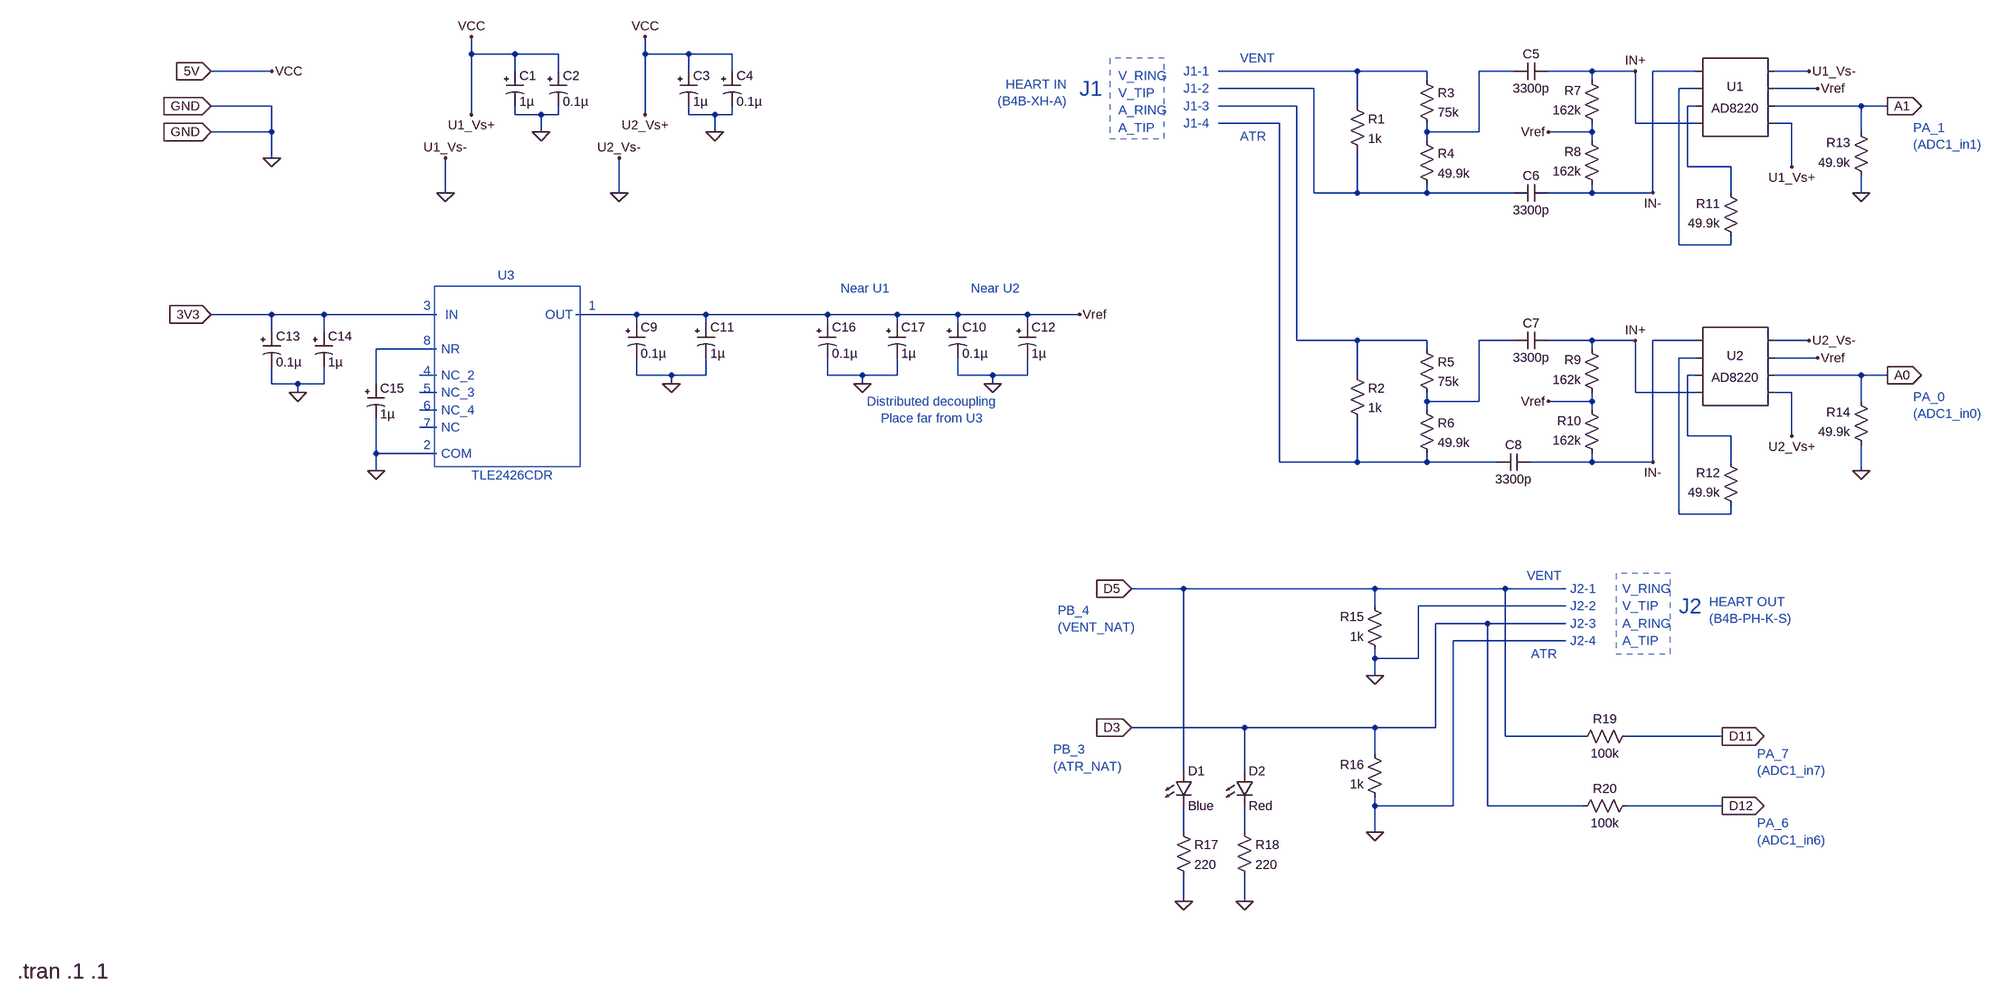
[diagram p0: schematic nucleo_shield_heart_interface_rev2.asc]
nucleo_shield_heart_interface_rev2.asc, the LTspice schematic file:
Version 4
SHEET 1 3972 3216
WIRE -1184 480 -1184 448
WIRE -1104 480 -1184 480
WIRE -1024 480 -1104 480
WIRE -864 480 -864 448
WIRE -784 480 -864 480
WIRE -704 480 -784 480
WIRE -1552 512 -1664 512
WIRE -1104 512 -1104 480
WIRE -1024 512 -1024 480
WIRE -784 512 -784 480
WIRE -704 512 -704 480
WIRE 448 512 192 512
WIRE 576 512 448 512
WIRE 736 512 672 512
WIRE 880 512 800 512
WIRE 960 512 880 512
WIRE 1072 512 992 512
WIRE 1280 512 1216 512
WIRE 576 528 576 512
WIRE 880 528 880 512
WIRE 368 544 192 544
WIRE 1072 544 1040 544
WIRE 1296 544 1216 544
WIRE -1552 576 -1664 576
WIRE 336 576 192 576
WIRE 448 576 448 512
WIRE 1072 576 1056 576
WIRE 1376 576 1216 576
WIRE 1424 576 1376 576
WIRE -1184 592 -1184 480
WIRE -1104 592 -1104 576
WIRE -1056 592 -1104 592
WIRE -1024 592 -1024 576
WIRE -1024 592 -1056 592
WIRE -864 592 -864 480
WIRE -784 592 -784 576
WIRE -736 592 -784 592
WIRE -704 592 -704 576
WIRE -704 592 -736 592
WIRE 304 608 192 608
WIRE 960 608 960 512
WIRE 1072 608 960 608
WIRE 1248 608 1216 608
WIRE -1552 624 -1552 576
WIRE -1552 624 -1664 624
WIRE -1056 624 -1056 592
WIRE -736 624 -736 592
WIRE 576 624 576 608
WIRE 672 624 672 512
WIRE 672 624 576 624
WIRE 880 624 880 608
WIRE 880 624 800 624
WIRE 1376 624 1376 576
WIRE 576 640 576 624
WIRE 880 640 880 624
WIRE -1552 672 -1552 624
WIRE 1056 688 1056 576
WIRE 1136 688 1056 688
WIRE 1248 688 1248 608
WIRE -1232 736 -1232 672
WIRE -912 736 -912 672
WIRE 368 736 368 544
WIRE 448 736 448 656
WIRE 448 736 368 736
WIRE 576 736 576 720
WIRE 576 736 448 736
WIRE 736 736 576 736
WIRE 880 736 880 720
WIRE 880 736 800 736
WIRE 992 736 992 512
WIRE 992 736 880 736
WIRE 1136 736 1136 688
WIRE 1376 736 1376 704
WIRE 1040 832 1040 544
WIRE 1136 832 1136 816
WIRE 1136 832 1040 832
WIRE -1552 960 -1664 960
WIRE -1456 960 -1552 960
WIRE -1248 960 -1456 960
WIRE -880 960 -992 960
WIRE -752 960 -880 960
WIRE -528 960 -752 960
WIRE -400 960 -528 960
WIRE -288 960 -400 960
WIRE -160 960 -288 960
WIRE -64 960 -160 960
WIRE -880 976 -880 960
WIRE -752 976 -752 960
WIRE -528 976 -528 960
WIRE -400 976 -400 960
WIRE -288 976 -288 960
WIRE -160 976 -160 960
WIRE -1552 992 -1552 960
WIRE -1456 992 -1456 960
WIRE 336 1008 336 576
WIRE 448 1008 336 1008
WIRE 576 1008 448 1008
WIRE 736 1008 672 1008
WIRE 880 1008 800 1008
WIRE 960 1008 880 1008
WIRE 1072 1008 992 1008
WIRE 1280 1008 1216 1008
WIRE -1248 1024 -1360 1024
WIRE 576 1024 576 1008
WIRE 880 1024 880 1008
WIRE 1072 1040 1040 1040
WIRE 1296 1040 1216 1040
WIRE -1248 1072 -1280 1072
WIRE -880 1072 -880 1040
WIRE -816 1072 -880 1072
WIRE -752 1072 -752 1040
WIRE -752 1072 -816 1072
WIRE -528 1072 -528 1040
WIRE -464 1072 -528 1072
WIRE -400 1072 -400 1040
WIRE -400 1072 -464 1072
WIRE -288 1072 -288 1040
WIRE -224 1072 -288 1072
WIRE -160 1072 -160 1040
WIRE -160 1072 -224 1072
WIRE 448 1072 448 1008
WIRE 1072 1072 1056 1072
WIRE 1376 1072 1216 1072
WIRE 1424 1072 1376 1072
WIRE -1552 1088 -1552 1056
WIRE -1504 1088 -1552 1088
WIRE -1456 1088 -1456 1056
WIRE -1456 1088 -1504 1088
WIRE -1360 1088 -1360 1024
WIRE -816 1088 -816 1072
WIRE -464 1088 -464 1072
WIRE -224 1088 -224 1072
WIRE -1504 1104 -1504 1088
WIRE -1248 1104 -1280 1104
WIRE 960 1104 960 1008
WIRE 1072 1104 960 1104
WIRE 1248 1104 1216 1104
WIRE 576 1120 576 1104
WIRE 672 1120 672 1008
WIRE 672 1120 576 1120
WIRE 880 1120 880 1104
WIRE 880 1120 800 1120
WIRE 1376 1120 1376 1072
WIRE -1248 1136 -1280 1136
WIRE 576 1136 576 1120
WIRE 880 1136 880 1120
WIRE -1248 1168 -1280 1168
WIRE 1056 1184 1056 1072
WIRE 1136 1184 1056 1184
WIRE 1248 1184 1248 1104
WIRE -1360 1216 -1360 1152
WIRE -1248 1216 -1360 1216
WIRE 304 1232 304 608
WIRE 448 1232 448 1152
WIRE 448 1232 304 1232
WIRE 576 1232 576 1216
WIRE 576 1232 448 1232
WIRE 704 1232 576 1232
WIRE 880 1232 880 1216
WIRE 880 1232 768 1232
WIRE 992 1232 992 1008
WIRE 992 1232 880 1232
WIRE 1136 1232 1136 1184
WIRE -1360 1248 -1360 1216
WIRE 1376 1248 1376 1200
WIRE 1040 1328 1040 1040
WIRE 1136 1328 1136 1312
WIRE 1136 1328 1040 1328
WIRE 128 1552 32 1552
WIRE 480 1552 128 1552
WIRE 720 1552 480 1552
WIRE 832 1552 720 1552
WIRE 480 1584 480 1552
WIRE 832 1584 560 1584
WIRE 688 1616 592 1616
WIRE 832 1616 688 1616
WIRE 832 1648 624 1648
WIRE 480 1680 480 1664
WIRE 560 1680 560 1584
WIRE 560 1680 480 1680
WIRE 480 1712 480 1680
WIRE 240 1808 32 1808
WIRE 480 1808 240 1808
WIRE 592 1808 592 1616
WIRE 592 1808 480 1808
WIRE 720 1824 720 1552
WIRE 864 1824 720 1824
WIRE 1120 1824 944 1824
WIRE 480 1856 480 1808
WIRE 128 1888 128 1552
WIRE 240 1888 240 1808
WIRE 480 1952 480 1936
WIRE 624 1952 624 1648
WIRE 624 1952 480 1952
WIRE 688 1952 688 1616
WIRE 864 1952 688 1952
WIRE 1120 1952 944 1952
WIRE 128 2000 128 1952
WIRE 240 2000 240 1952
WIRE 480 2000 480 1952
WIRE 128 2128 128 2080
WIRE 240 2128 240 2080
FLAG 960 512 IN+
FLAG 992 736 IN-
FLAG 1424 576 A1
IOPIN 1424 576 Out
FLAG 1296 544 Vref
FLAG 800 624 Vref
FLAG 960 1008 IN+
FLAG 992 1232 IN-
FLAG 1424 1072 A0
IOPIN 1424 1072 Out
FLAG 1296 1040 Vref
FLAG 800 1120 Vref
FLAG 1376 736 0
FLAG 1376 1248 0
FLAG 32 1552 D5
IOPIN 32 1552 In
FLAG 32 1808 D3
IOPIN 32 1808 In
FLAG 128 2128 0
FLAG 240 2128 0
FLAG 480 1712 0
FLAG 480 2000 0
FLAG -1184 592 U1_Vs+
FLAG 1248 688 U1_Vs+
FLAG -1184 448 VCC
FLAG -1232 736 0
FLAG -1232 672 U1_Vs-
FLAG -1056 624 0
FLAG 1280 512 U1_Vs-
FLAG -864 592 U2_Vs+
FLAG -864 448 VCC
FLAG -912 736 0
FLAG -912 672 U2_Vs-
FLAG -736 624 0
FLAG 1280 1008 U2_Vs-
FLAG 1248 1184 U2_Vs+
FLAG -64 960 Vref
FLAG -816 1088 0
FLAG -464 1088 0
FLAG -1360 1248 0
FLAG -1504 1104 0
FLAG -1664 512 5V
IOPIN -1664 512 In
FLAG -1664 576 GND
IOPIN -1664 576 In
FLAG -1664 624 GND
IOPIN -1664 624 In
FLAG -1552 512 VCC
FLAG -1552 672 0
FLAG -1664 960 3V3
IOPIN -1664 960 In
FLAG 1120 1952 D12
IOPIN 1120 1952 Out
FLAG 1120 1824 D11
IOPIN 1120 1824 Out
FLAG -224 1088 0
SYMBOL res 432 560 R0
SYMATTR InstName R1
SYMATTR Value 1k
SYMBOL res 896 736 R180
WINDOW 0 36 76 Left 2
WINDOW 3 36 40 Left 2
SYMATTR InstName R8
SYMATTR Value 162k
SYMBOL res 896 624 R180
WINDOW 0 36 76 Left 2
WINDOW 3 36 40 Left 2
SYMATTR InstName R7
SYMATTR Value 162k
SYMBOL cap 800 496 R90
WINDOW 0 0 32 VBottom 2
WINDOW 3 32 32 VTop 2
SYMATTR InstName C5
SYMATTR Value 3300p
SYMBOL cap 800 720 R90
WINDOW 0 0 32 VBottom 2
WINDOW 3 32 32 VTop 2
SYMATTR InstName C6
SYMATTR Value 3300p
SYMBOL res 1152 832 R180
WINDOW 0 36 76 Left 2
WINDOW 3 36 40 Left 2
SYMATTR InstName R11
SYMATTR Value 49.9k
SYMBOL res 560 512 R0
SYMATTR InstName R3
SYMATTR Value 75k
SYMBOL res 560 624 R0
SYMATTR InstName R4
SYMATTR Value 49.9k
SYMBOL AutoGenerated/AD8220 1136 560 R0
SYMATTR InstName U1
SYMBOL res 432 1056 R0
SYMATTR InstName R2
SYMATTR Value 1k
SYMBOL res 896 1232 R180
WINDOW 0 36 76 Left 2
WINDOW 3 36 40 Left 2
SYMATTR InstName R10
SYMATTR Value 162k
SYMBOL res 896 1120 R180
WINDOW 0 36 76 Left 2
WINDOW 3 36 40 Left 2
SYMATTR InstName R9
SYMATTR Value 162k
SYMBOL cap 800 992 R90
WINDOW 0 0 32 VBottom 2
WINDOW 3 32 32 VTop 2
SYMATTR InstName C7
SYMATTR Value 3300p
SYMBOL cap 768 1216 R90
WINDOW 0 0 32 VBottom 2
WINDOW 3 32 32 VTop 2
SYMATTR InstName C8
SYMATTR Value 3300p
SYMBOL res 1152 1328 R180
WINDOW 0 36 76 Left 2
WINDOW 3 36 40 Left 2
SYMATTR InstName R12
SYMATTR Value 49.9k
SYMBOL res 560 1008 R0
SYMATTR InstName R5
SYMATTR Value 75k
SYMBOL res 560 1120 R0
SYMATTR InstName R6
SYMATTR Value 49.9k
SYMBOL AutoGenerated/AD8220 1136 1056 R0
SYMATTR InstName U2
SYMBOL res 1392 720 R180
WINDOW 0 36 76 Left 2
WINDOW 3 36 40 Left 2
SYMATTR InstName R13
SYMATTR Value 49.9k
SYMBOL res 1392 1216 R180
WINDOW 0 36 76 Left 2
WINDOW 3 36 40 Left 2
SYMATTR InstName R14
SYMATTR Value 49.9k
SYMBOL LED 112 1888 R0
SYMATTR InstName D1
SYMATTR Value Blue
SYMBOL LED 224 1888 R0
SYMATTR InstName D2
SYMATTR Value Red
SYMBOL res 112 1984 R0
SYMATTR InstName R17
SYMATTR Value 220
SYMBOL res 224 1984 R0
SYMATTR InstName R18
SYMATTR Value 220
SYMBOL res 496 1680 R180
WINDOW 0 36 76 Left 2
WINDOW 3 36 40 Left 2
SYMATTR InstName R15
SYMATTR Value 1k
SYMBOL res 496 1952 R180
WINDOW 0 36 76 Left 2
WINDOW 3 36 40 Left 2
SYMATTR InstName R16
SYMATTR Value 1k
SYMBOL polcap -1120 512 R0
SYMATTR InstName C1
SYMATTR Value 1µ
SYMBOL polcap -1040 512 R0
SYMATTR InstName C2
SYMATTR Value 0.1µ
SYMBOL polcap -800 512 R0
SYMATTR InstName C3
SYMATTR Value 1µ
SYMBOL polcap -720 512 R0
SYMATTR InstName C4
SYMATTR Value 0.1µ
SYMBOL polcap -896 976 R0
SYMATTR InstName C9
SYMATTR Value 0.1µ
SYMBOL polcap -304 976 R0
SYMATTR InstName C10
SYMATTR Value 0.1µ
SYMBOL polcap -176 976 R0
SYMATTR InstName C12
SYMATTR Value 1µ
SYMBOL polcap -768 976 R0
SYMATTR InstName C11
SYMATTR Value 1µ
SYMBOL polcap -544 976 R0
SYMATTR InstName C16
SYMATTR Value 0.1µ
SYMBOL polcap -416 976 R0
SYMATTR InstName C17
SYMATTR Value 1µ
SYMBOL polcap -1568 992 R0
SYMATTR InstName C13
SYMATTR Value 0.1µ
SYMBOL polcap -1472 992 R0
SYMATTR InstName C14
SYMATTR Value 1µ
SYMBOL polcap -1376 1088 R0
SYMATTR InstName C15
SYMATTR Value 1µ
SYMBOL res 848 1840 R270
WINDOW 0 32 56 VTop 2
WINDOW 3 0 56 VBottom 2
SYMATTR InstName R19
SYMATTR Value 100k
SYMBOL res 848 1968 R270
WINDOW 0 32 56 VTop 2
WINDOW 3 0 56 VBottom 2
SYMATTR InstName R20
SYMATTR Value 100k
TEXT -2064 2256 Left 4 !.tran .1 .1
TEXT -88 536 Right 2 ;HEART IN\n(B4B-XH-A)
TEXT 232 488 Left 2 ;VENT
TEXT 232 632 Left 2 ;ATR
TEXT 1096 1576 Left 2 ;HEART OUT\n(B4B-PH-K-S)
TEXT -1184 1256 Left 2 ;TLE2426CDR
TEXT -1136 888 Left 2 ;U3
TEXT -1048 960 Left 2 ;OUT
TEXT -1240 1072 Left 2 ;NC_2
TEXT -1240 1104 Left 2 ;NC_3
TEXT -1240 1136 Left 2 ;NC_4
TEXT -1240 1168 Left 2 ;NC
TEXT -1272 1064 Left 2 ;4
TEXT -1272 1096 Left 2 ;5
TEXT -1272 1128 Left 2 ;6
TEXT -1272 1160 Left 2 ;7
TEXT -1272 1200 Left 2 ;2
TEXT -1240 1216 Left 2 ;COM
TEXT -1240 1024 Left 2 ;NR
TEXT -1272 1008 Left 2 ;8
TEXT -1232 960 Left 2 ;IN
TEXT -1272 944 Left 2 ;3
TEXT -336 1136 Center 2 ;Distributed decoupling\nPlace far from U3
TEXT -968 944 Left 2 ;1
TEXT -64 544 Left 4 ;J1
TEXT 1040 1584 Left 4 ;J2
TEXT 128 512 Left 2 ;J1-1
TEXT 128 544 Left 2 ;J1-2
TEXT 128 576 Left 2 ;J1-3
TEXT 128 608 Left 2 ;J1-4
TEXT 840 1552 Left 2 ;J2-1
TEXT 840 1584 Left 2 ;J2-2
TEXT 840 1616 Left 2 ;J2-3
TEXT 840 1648 Left 2 ;J2-4
TEXT -104 1592 Left 2 ;PB_4\n(VENT_NAT)
TEXT -112 1848 Left 2 ;PB_3\n(ATR_NAT)
TEXT 1472 616 Left 2 ;PA_1\n(ADC1_in1)
TEXT 1472 1112 Left 2 ;PA_0\n(ADC1_in0)
TEXT 760 1528 Left 2 ;VENT
TEXT 768 1672 Left 2 ;ATR
TEXT 936 1552 Left 2 ;V_RING
TEXT 936 1584 Left 2 ;V_TIP
TEXT 936 1616 Left 2 ;A_RING
TEXT 936 1648 Left 2 ;A_TIP
TEXT 1184 1856 Left 2 ;PA_7\n(ADC1_in7)
TEXT 1184 1984 Left 2 ;PA_6\n(ADC1_in6)
TEXT 8 520 Left 2 ;V_RING
TEXT 8 552 Left 2 ;V_TIP
TEXT 8 584 Left 2 ;A_RING
TEXT 8 616 Left 2 ;A_TIP
TEXT -504 912 Left 2 ;Near U1
TEXT -264 912 Left 2 ;Near U2
RECTANGLE Normal -1252 908 -984 1240
RECTANGLE Normal 1024 1524 924 1672 2
RECTANGLE Normal 92 488 -8 636 2

The netlist it stands for:
* nucleo_shield_heart_interface_rev2.asc
R1 N001 N003 1k
R8 IN- Vref 162k
R7 Vref IN+ 162k
C5 IN+ N002 3300p
C6 IN- N003 3300p
R11 N004 N006 49.9k
R3 N001 N002 75k
R4 N002 N003 49.9k
* U1: AD8220 (symbol AutoGenerated/AD8220 not available, pins judged from their places): pin1=IN- pin2=N004 pin3=N006 pin4=IN+ pin5=0 pin6=Vref pin7=A1 pin8=5V
R2 N005 N007 1k
R10 IN- Vref 162k
R9 Vref IN+ 162k
C7 IN+ N008 3300p
C8 IN- N007 3300p
R12 N010 N012 49.9k
R5 N005 N008 75k
R6 N008 N007 49.9k
* U2: AD8220 (symbol AutoGenerated/AD8220 not available, pins judged from their places): pin1=IN- pin2=N010 pin3=N012 pin4=IN+ pin5=0 pin6=Vref pin7=A0 pin8=5V
R13 0 A1 49.9k
R14 0 A0 49.9k
D1 D5 N016 Blue
D2 D3 N017 Red
R17 N016 0 220
R18 N017 0 220
R15 0 D5 1k
R16 0 D3 1k
C1 5V 0 1µ
C2 5V 0 0.1µ
C3 5V 0 1µ
C4 5V 0 0.1µ
C9 Vref 0 0.1µ
C10 Vref 0 0.1µ
C12 Vref 0 1µ
C11 Vref 0 1µ
C16 Vref 0 0.1µ
C17 Vref 0 1µ
C13 3V3 0 0.1µ
C14 3V3 0 1µ
C15 N009 0 1µ
R19 D5 D11 100k
R20 D3 D12 100k
.model D D
.lib standard.dio
.tran .1 .1
* HEART IN
* (B4B-XH-A)
* VENT
* ATR
* HEART OUT
* (B4B-PH-K-S)
* TLE2426CDR
* U3
* OUT
* NC_2
* NC_3
* NC_4
* NC
* 4
* 5
* 6
* 7
* 2
* COM
* NR
* 8
* IN
* 3
* Distributed decoupling
* Place far from U3
* 1
* J1
* J2
* J1-1
* J1-2
* J1-3
* J1-4
* J2-1
* J2-2
* J2-3
* J2-4
* PB_4
* (VENT_NAT)
* PB_3
* (ATR_NAT)
* PA_1
* (ADC1_in1)
* PA_0
* (ADC1_in0)
* VENT
* ATR
* V_RING
* V_TIP
* A_RING
* A_TIP
* PA_7
* (ADC1_in7)
* PA_6
* (ADC1_in6)
* V_RING
* V_TIP
* A_RING
* A_TIP
* Near U1
* Near U2
.backanno
.end